# Altium schematic sheet 08_EXP_CN.SchDoc
size A2; ApprovedBy: DNP; CheckedBy: DNP; Author: DNP; CompanyName: Google LLC; DrawnBy: DNP; Engineer: Bangfei/Michael/Leo; Organization: Google LLC; Address1: 1600 Amphitheatre Parkway; Address2: Mountain View, CA 94043; Address3: DNP; Address4: DNP; DocumentNumber: DNP; Revision: PVT; SheetNumber: 8; SheetTotal: 11; VersionControl_RevNumber: DNP; IsUserConfigurable: DNP; Time: DNP; ImagePath: DNP; Rule: DNP; ProjectName: Enterprise; Application_BuildNumber: DNP
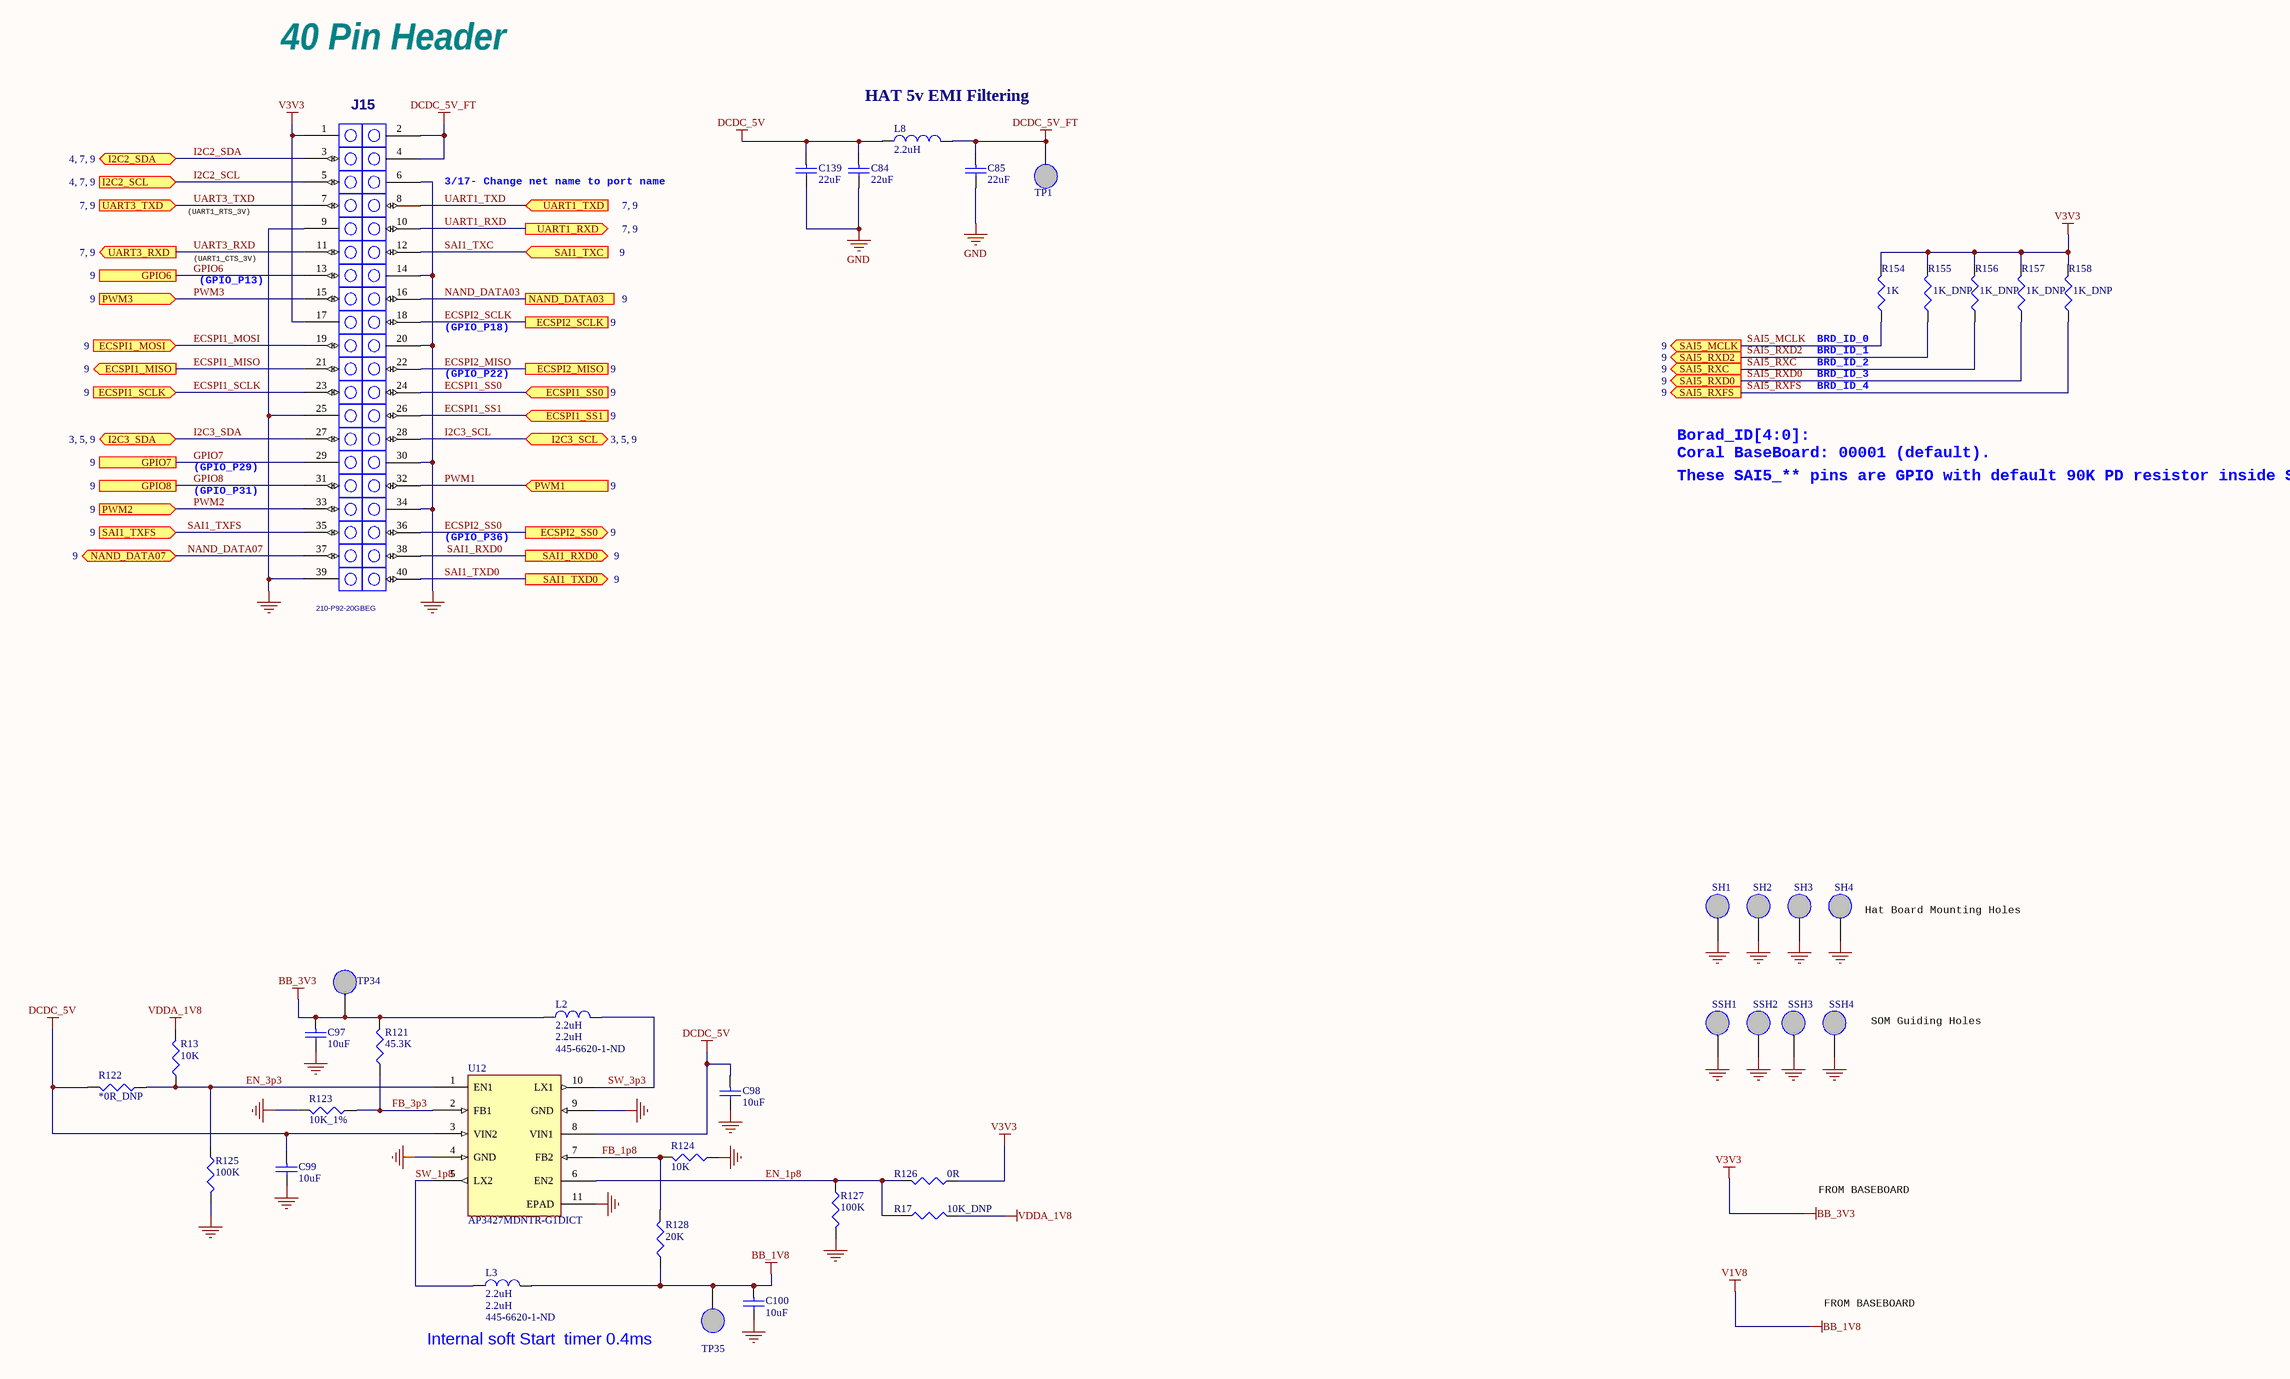
[diagram p0: 08_EXP_CN.SchDoc]

## Parts
C84  value 22uF  [0603]  (hidden comment: 22uF/10V)
C85  value 22uF  [0603]  (hidden comment: 22uF/10V)
C97  value 10uF  [0402]  (hidden comment: 10uF/10V)
C98  value 10uF  [0402]  (hidden comment: 10uF/10V)
C99  value 10uF  [0402]  (hidden comment: 10uF/10V)
C100  value 10uF  [0402]  (hidden comment: 10uF/10V)
C139  value 22uF  [0603]  (hidden comment: 22uF/10V)
J15  210-P92-20GBEG  [HTSW-120-41-G-D]
L2  2.2uH  Supplier Part Number 1: 445-6620-1-ND  [INDC2016X12L]
L3  2.2uH  Supplier Part Number 1: 445-6620-1-ND  [INDC2016X12L]
L8  2.2uH  [0805_PADS]
R13  value 10K  [0201]  (hidden comment: 10K_DNP)
R17  10K_DNP  [0201]
R121  45.3K  [0201]
R122  value *0R_DNP  [0201]  (hidden comment: 0R)
R123  value 10K_1%  [0201]  (hidden comment: 10K)
R124  10K  [0201]
R125  100K  [0201]
R126  0R  [0201]
R127  100K  [0201]
R128  20K  [0201]
R154  value 1K  [0201]  (hidden comment: 1K/1%)
R155  1K_DNP  [0201]
R156  1K_DNP  [0201]
R157  1K_DNP  [0201]
R158  1K_DNP  [0201]
SH1  TP NM  [hole236-110]  (value not drawn)  (no BOM)
SH2  TP NM  [hole236-110]  (value not drawn)  (no BOM)
SH3  TP NM  [hole236-110]  (value not drawn)  (no BOM)
SH4  TP NM  [hole236-110]  (value not drawn)  (no BOM)
SSH1  stand-off  [hole120-80]  (value not drawn)  (no BOM)
SSH2  stand-off  [hole120-80]  (value not drawn)  (no BOM)
SSH3  stand-off  [hole120-80]  (value not drawn)  (no BOM)
SSH4  stand-off  [hole120-80]  (value not drawn)  (no BOM)
TP1  TP NM  [TP_SMD]  (value not drawn)  (no BOM)
TP34  TP NM  [TP_SMD_L]  (value not drawn)  (no BOM)
TP35  TP NM  [TP_SMD_L]  (value not drawn)  (no BOM)
U12  AP3427MDNTR-G1DICT  [DFN_10_3X3]

## Ports
ECSPI1_MISO (out, see 9), ECSPI1_MOSI (in, see 9), ECSPI1_SCLK (in, see 9), ECSPI1_SS0 (in, see 9), ECSPI1_SS1 (in, see 9), ECSPI2_MISO (see 9), ECSPI2_SCLK (see 9), ECSPI2_SS0 (out, see 9), GPIO6 (see 9), GPIO7 (see 9), GPIO8 (see 9), I2C2_SCL (in, see 4, 7, 9), I2C2_SDA (bidir, see 4, 7, 9), I2C3_SCL (bidir, see 3, 5, 9), I2C3_SDA (bidir, see 3, 5, 9), NAND_DATA03 (see 9), NAND_DATA07 (bidir, see 9), PWM1 (in, see 9), PWM2 (in, see 9), PWM3 (in, see 9), SAI1_RXD0 (out, see 9), SAI1_TXC (in, see 9), SAI1_TXD0 (out, see 9), SAI1_TXFS (in, see 9), SAI5_MCLK (out, see 9), SAI5_RXC (out, see 9), SAI5_RXD0 (out, see 9), SAI5_RXD2 (out, see 9), SAI5_RXFS (out, see 9), UART1_RXD (out, see 7, 9), UART1_TXD (in, see 7, 9), UART3_RXD (out, see 7, 9), UART3_TXD (in, see 7, 9)

## Nets
BB_1V8: C100.1 L3.2 R128.1 TP35.1  [also labelled V1V8]
BB_3V3: C97.1 J15.1 J15.17 L2.1 R121.2 R126.1 R154.2 R155.2 R156.2 R157.2 R158.2 TP34.1  [also labelled V3V3]
DCDC_5V: C84.1 C98.1 C99.1 C139.1 L8.1 R122.2 U12.3(VIN2) U12.8(VIN1)
DCDC_5V_FT: C85.1 J15.2 J15.4 L8.2 TP1.1
GND: C84.2 C85.2 C97.2 C98.2 C99.2 C100.2 C139.2 J15.6 J15.9 J15.14 J15.20 J15.25 J15.30 J15.34 J15.39 R123.2 R124.1 R125.2 R127.2 SH1.1 SH2.1 SH3.1 SH4.1 SSH1.1 SSH2.1 SSH3.1 SSH4.1 U12.4(GND) U12.9(GND) U12.11(EPAD)
VDDA_1V8: R13.2 R17.2
ECSPI1_MISO: J15.21 ; port ECSPI1_MISO
ECSPI1_MOSI: J15.19 ; port ECSPI1_MOSI
ECSPI1_SCLK: J15.23 ; port ECSPI1_SCLK
ECSPI1_SS0: J15.24 ; port ECSPI1_SS0
ECSPI1_SS1: J15.26 ; port ECSPI1_SS1
ECSPI2_MISO: J15.22 ; port ECSPI2_MISO
ECSPI2_SCLK: J15.18 ; port ECSPI2_SCLK
ECSPI2_SS0: J15.36 ; port ECSPI2_SS0
EN_1p8: R17.1 R126.2 R127.1 U12.6(EN2)
EN_3p3: R13.1 R122.1 R125.1 U12.1(EN1)
FB_1p8: R124.2 R128.2 U12.7(FB2)
FB_3p3: R121.1 R123.1 U12.2(FB1)
GPIO6: J15.13 ; port GPIO6
GPIO7: J15.29 ; port GPIO7
GPIO8: J15.31 ; port GPIO8
I2C2_SCL: J15.5 ; port I2C2_SCL
I2C2_SDA: J15.3 ; port I2C2_SDA
I2C3_SCL: J15.28 ; port I2C3_SCL
I2C3_SDA: J15.27 ; port I2C3_SDA
NAND_DATA03: J15.16 ; port NAND_DATA03
NAND_DATA07: J15.37 ; port NAND_DATA07
PWM1: J15.32 ; port PWM1
PWM2: J15.33 ; port PWM2
PWM3: J15.15 ; port PWM3
SAI1_RXD0: J15.38 ; port SAI1_RXD0
SAI1_TXC: J15.12 ; port SAI1_TXC
SAI1_TXD0: J15.40 ; port SAI1_TXD0
SAI1_TXFS: J15.35 ; port SAI1_TXFS
SAI5_MCLK: R154.1 ; port SAI5_MCLK
SAI5_RXC: R156.1 ; port SAI5_RXC
SAI5_RXD0: R157.1 ; port SAI5_RXD0
SAI5_RXD2: R155.1 ; port SAI5_RXD2
SAI5_RXFS: R158.1 ; port SAI5_RXFS
SW_1p8: L3.1 U12.5(LX2)
SW_3p3: L2.2 U12.10(LX1)
UART1_RXD: J15.10 ; port UART1_RXD
UART1_TXD: J15.8 ; port UART1_TXD
UART3_RXD: J15.11 ; port UART3_RXD
UART3_TXD: J15.7 ; port UART3_TXD

## Notes on the sheet
- 40 Pin Header
- (near L8) HAT 5v EMI Filtering
- 3/17- Change net name to port name
- (UART1_RTS_3V)
- (UART1_CTS_3V)
- (GPIO_P13)
- (GPIO_P18)
- (near R154) BRD_ID_0
- (near R154) BRD_ID_1
- BRD_ID_2
- (GPIO_P22)
- BRD_ID_3
- BRD_ID_4
- (GPIO_P29)
- Borad_ID[4:0]:
- These SAI5_** pins are GPIO with default 90K PD resistor inside SOC.
- Coral BaseBoard: 00001 (default).
- (GPIO_P31)
- (GPIO_P36)
- (near SH4) Hat Board Mounting Holes
- (near SSH4) SOM Guiding Holes
- FROM BASEBOARD
- (near TP35) Internal soft Start  timer 0.4ms
- Project:
- Engineer:
- Date:
- File:
- Revision:
- Sheet
- of

## Library data of the parts
C84 C139 = CAP_0603_22uF: CAP CER 22UF 6.3V 10% X5R 0603; MPN: CL10A226KQ8NRNE; QCI MPN: GRM188R61A226M; QPN: CH6222M9901; QPN Description: CAP CHIP 22UF 10V(+-20%,X5R,0603); Function Code: USB; Supplier 1: Digi-Key; Supplier Part Number 1: 1276-2867-2-ND; QCI Supplier: MUR
C85 = CAP_0603_22uF: CAP CER 22UF 6.3V 10% X5R 0603; MPN: CL10A226KQ8NRNE; QCI MPN: GRM188R61A226M; QPN: CH6222M9901; QPN Description: CAP CHIP 22UF 10V(+-20%,X5R,0603); Function Code: DOK; Supplier 1: Digi-Key; Supplier Part Number 1: 1276-2867-2-ND; QCI Supplier: MUR
C97-C100 = CAP_0402_10uF: CAP CER 10UF 10V 20% X5R 0402; MPN: CL05A106MP5NUNC; QCI MPN: GRM155R61A106M; QPN: CH6102M9B00; QPN Description: CAP CHIP 10U 10V (+-20%, X5R, 0402)'; Function Code: DCD; Supplier 1: Digi-Key; Supplier Part Number 1: 1276-1450-1-ND; QCI Supplier: MUR
J15 = CONN_HEADER_20x2_SMT: SOCKET 2X20 100-MIL STRAIGHT SMT; Function Code: DOK; QPN: DFHD20MS161; QPN Description: CONN DIP HEADER 20P 2R MS(P2.54,H8.3); Supplier 1: Samtec; Supplier Part Number 1: 210-P92-20GBEG; MPN: 210-P92-20GBEG; QCI MPN: 210-P92-20GBEG; QCI Supplier: PRX
L2 L3 = INDUCTOR_VLS201612ET-2R2M: FIXED IND 2.2UH 1.05A 195 MOHM SMD; QPN: CV-2210MZ02; QPN Description: IND SMD2.2UH+-20%1.05A(VLS201612ET-2R2M); Function Code: DCD; Supplier 1: Digi-Key; Value: 2.2uH; MPN: VLS201612ET-2R2M; QCI MPN: VLS201612ET-2R2M; QCI Supplier: TDK
L8 = INDUCTOR_2.2uH_800mA_0805: 2.2?Inductor 800mA 200 mOhm Max 0805 (2012 Metric); MPN: SDTR20120H-2R2MS; QPN: CV-2213MZ14; Function Code: DOK; QPN Description: IND SMD 2.2UH +-20%1.3A SDTR20120H-2R2MS; Value: 2.2uH; QCI Supplier: CYN; QCI MPN: SDTR20120H-2R2MS
R13 R17 = R_0201_10K: RES SMD 10K OHM JUMPER 1/20W  0201; MPN: ERJ-1GEF103C; QCI MPN: RC0201JR-1310KL; DNP: V; QPN: CS31001JE16; QPN Description: RES CHIP 10K 1/20W +-5%(0201); Function Code: DCD; Supplier 1: Digi-Key; Supplier Part Number 1: P10.0KABCT-ND; QCI Supplier: YGO
  R17: VALUE: 10K_DNP
R121 = R_0201_453K: RES CHIP 45.3K 1/20W +-1%(0201); MPN: RM02FTN4532; QPN: CS34531FE01; Function Code: DCD; Supplier 1: Digi-Key; VALUE: 45.3K; Supplier Part Number 1: P453KABCT-ND; QCI MPN: RM02FTN4532; QCI Supplier: YGO; QPN Description: RES CHIP 45.3K 1/20W +-1%(0201)
R122 R126 = R_0201_0: RES SMD 0.0OHM JUMPER 1/20W 0201; MPN: ERJ-1GN0R00C; QCI MPN: RC0201JR-130RL; QPN: CS00001JE18; QPN Description: RES CHIP 0(1/20W,+-5%,0201); Function Code: DCD; Supplier 1: Digi-Key; Supplier Part Number 1: P15979CT-ND; QCI Supplier: YGO
  R126: VALUE: 0R
R123 = R_0201_10K: RES SMD 10K OHM JUMPER 1/20W  0201; MPN: ERJ-1GEF103C; QCI MPN: RC0201JR-1310KL; QPN: CS31001FE14; QPN Description: RES CHIP 10K 1/20W +-1%(0201); Function Code: DCD; Supplier 1: Digi-Key; Supplier Part Number 1: P10.0KABCT-ND; QCI Supplier: YGO
R124 = R_0201_10K: RES SMD 10K OHM JUMPER 1/20W  0201; MPN: ERJ-1GEF103C; QCI MPN: RC0201JR-1310KL; QPN: CS31001JE16; QPN Description: RES CHIP 10K 1/20W +-5%(0201); Function Code: DCD; Supplier 1: Digi-Key; Supplier Part Number 1: P10.0KABCT-ND; VALUE: 10K; QCI Supplier: YGO
R125 R127 = R_0201_100K: RES SMD 100K OHM JUMPER 1/20W  0201; MPN: ERJ-1GEF1003C; QCI MPN: RC0201FR-07100KL; QPN: TS41001FE04; QPN Description: RES CHIP 100K 1/20W +-1%(0201)EMS-SEL; Function Code: DCD; Supplier 1: Digi-Key; VALUE: 100K; Supplier Part Number 1: P100KABCT-ND; QCI Supplier: YGO
R128 = R_0201_20K: RES SMD 20K OHM 1% 1/20W 0201; MPN: ERJ-1GEF2002C; QCI MPN: RC0201FR-0720KL; QPN: CS32001FE00; QPN Description: RES CHIP 20K 1/20W +-1%(0201); Function Code: DCD; Supplier 1: Digi-Key; Supplier Part Number 1: P20.0KABCT-ND; VALUE: 20K; QCI Supplier: YGO
R154 = R_0201_1K: RES SMD 1K OHM 1% 1/20W 0201; MPN: ERJ-1GEF1001C; QCI MPN: RC0201FR-131KL; QPN: CS21001FE04; QPN Description: RES CHIP 1K 1/20W +-1%(0201); Function Code: DOK; Supplier 1: Digi-Key; Supplier Part Number 1: P1.00KABCT-ND; QCI Supplier: YGO
R155-R158 = R_0201_1K: RES SMD 1K OHM 1% 1/20W 0201; MPN: ERJ-1GEF1001C; QCI MPN: RC0201FR-131KL; DNP: V; QPN: CS21001FE04; QPN Description: RES CHIP 1K 1/20W +-1%(0201); Function Code: DOK; Supplier 1: Digi-Key; Supplier Part Number 1: P1.00KABCT-ND; VALUE: 1K_DNP; QCI Supplier: YGO
SH1-SH4 TP1 = TP: TEST POIN
SSH1-SSH4 = TP: QCI MPN: 1000401131
TP34 TP35 = TP_L: TEST POINT (Large)
U12 = AP3427M: Dual 1A, 1.5NMhz, Sync Step-Down DC/DC Converter; QPN: LL003427000; QPN Description: IC OTHER(10P)AP3427MDNTR(DFN3030)ESEL; Function Code: DCD; Supplier 1: Digi-Key; Supplier Part Number 1: AP3427MDNTR-G1DICT-ND; MPN: AP3427MDNTR-G1DICT; QCI MPN: AP3427MDNTR-G1; QCI Supplier: DDS